# EAGLE design left thumb (EAGLE 9.4.2)
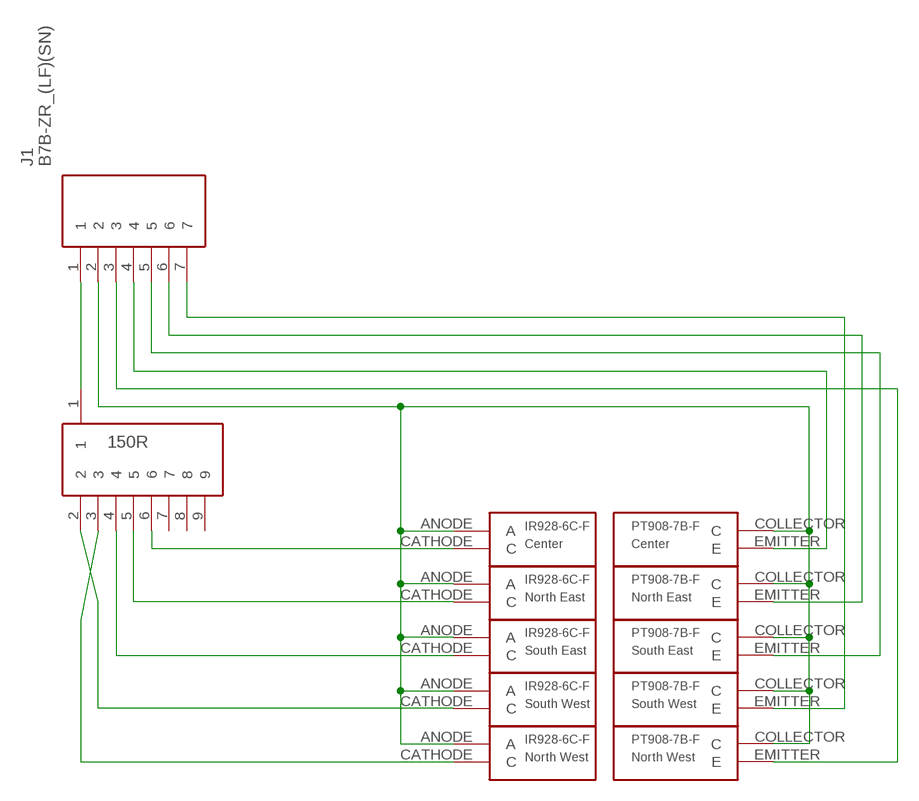
[diagram p0: schematic, sheet 1]

## Parts
J1  B7B-ZR_(LF)(SN)  [SHDR7W50P0X150_1X7_1200X350X45]
LED1  Center  IR928-6C-F  [IR928-6C-F]
LED2  North East  IR928-6C-F  [IR928-6C-F]
LED3  South East  IR928-6C-F  [IR928-6C-F]
LED4  South West  IR928-6C-F  [IR928-6C-F]
LED5  North West  IR928-6C-F  [IR928-6C-F]
PT1  Center  PT908-7B-F  [PT908-7B-F]
PT2  North East  PT908-7B-F  [PT908-7B-F]
PT3  South East  PT908-7B-F  [PT908-7B-F]
PT4  South West  PT908-7B-F  [PT908-7B-F]
PT5  North West  PT908-7B-F  [PT908-7B-F]
RN1  150R  9PIN-RESISTOR-NETWORK9PIN-RESISTOR-NETWORK  [9PIN-RESISTOR-NETWORK]

## Nets
N$1: J1.1 RN1.1
N$2: LED5.CATHODE(C) RN1.3
N$3: LED4.CATHODE(C) RN1.2
N$4: LED3.CATHODE(C) RN1.4
N$5: LED2.CATHODE(C) RN1.5
N$6: LED1.CATHODE(C) RN1.6
N$7: J1.2 LED1.ANODE(A) LED2.ANODE(A) LED3.ANODE(A) LED4.ANODE(A) LED5.ANODE(A) PT1.COLLECTOR(C) PT2.COLLECTOR(C) PT3.COLLECTOR(C) PT4.COLLECTOR(C) PT5.COLLECTOR(C)
N$8: J1.4 PT1.EMITTER(E)
N$9: J1.6 PT2.EMITTER(E)
N$10: J1.5 PT3.EMITTER(E)
N$11: J1.7 PT4.EMITTER(E)
N$12: J1.3 PT5.EMITTER(E)
Unconnected: RN1.7 RN1.8 RN1.9

## Library data of the parts
J1 = SamacSys_Parts:B7B-ZR_(LF)(SN): Connector,Multipole,PCB use,B7B-ZR (LF)( JST ZH Series, 1.5mm Pitch 7 Way 1 Row Straight PCB Header, Solder Termination, 1A Source: Datasheet <http://docs-emea.rs-online.com/webdocs/1147/0900766b81147f94.pdf>; DESCRIPTION: Connector,Multipole,PCB use,B7B-ZR (LF)( JST ZH Series, 1.5mm Pitch 7 Way 1 Row Straight PCB Header, Solder Termination, 1A; HEIGHT: 4.5mm; MANUFACTURER_NAME: JST (JAPAN SOLDERLESS TERMINALS); MANUFACTURER_PART_NUMBER: B7B-ZR (LF)(SN); RS_PART_NUMBER: 7620828; RS_PRICE-STOCK: https://uk.rs-online.com/web/p/products/7620828
LED1-LED5 = IR928-6C-F:IR928-6C-F
PT1-PT5 = PT908-7B-F:PT908-7B-F
RN1 = 9 pin resistor network:9PIN-RESISTOR-NETWORK: 9 pin, standard resistor network; HEIGHT: mm

## Board
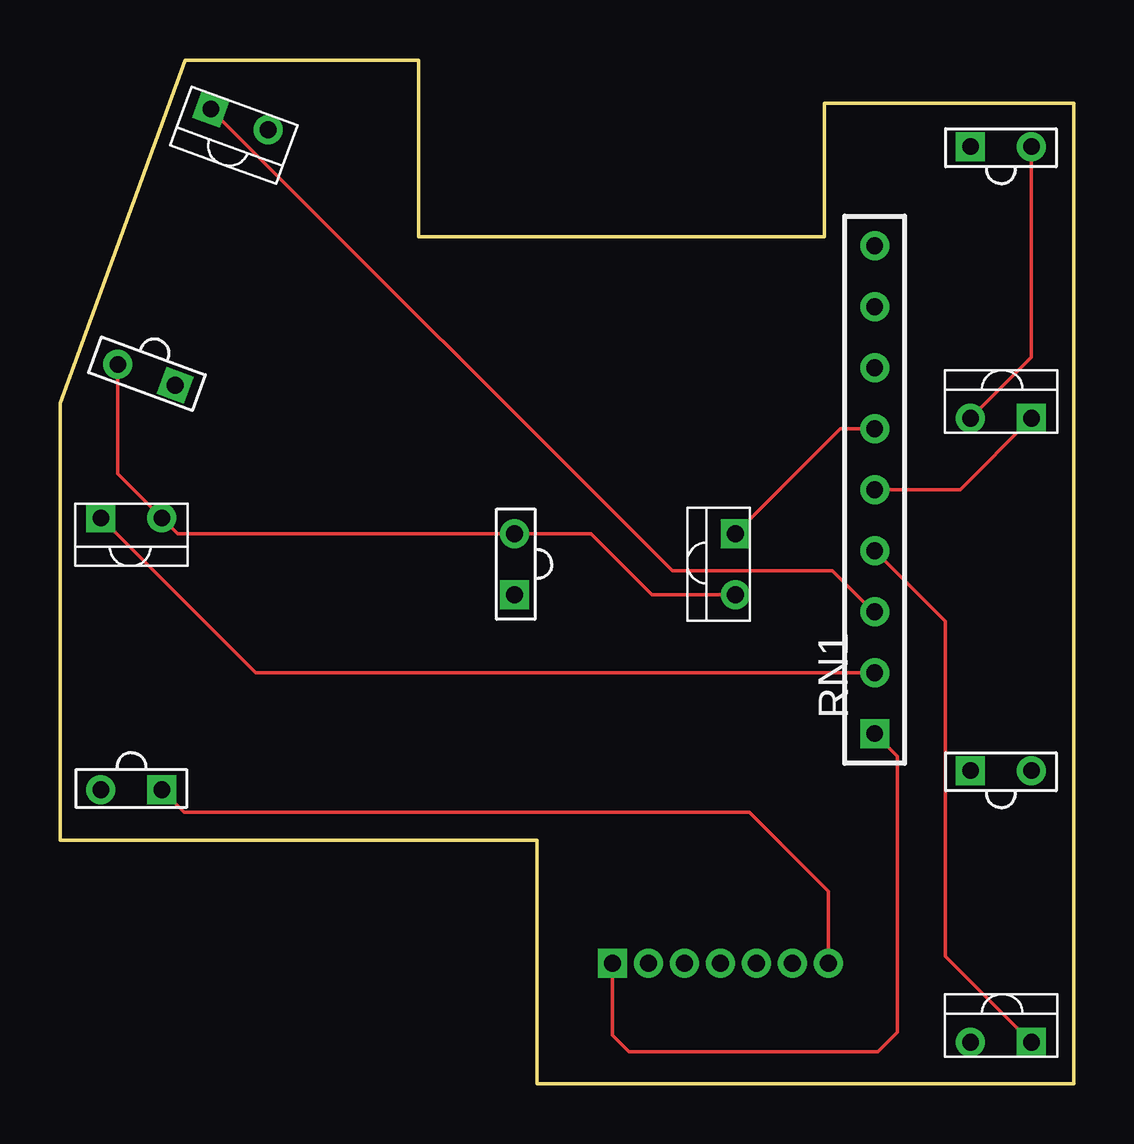
[diagram p1: board, top side]
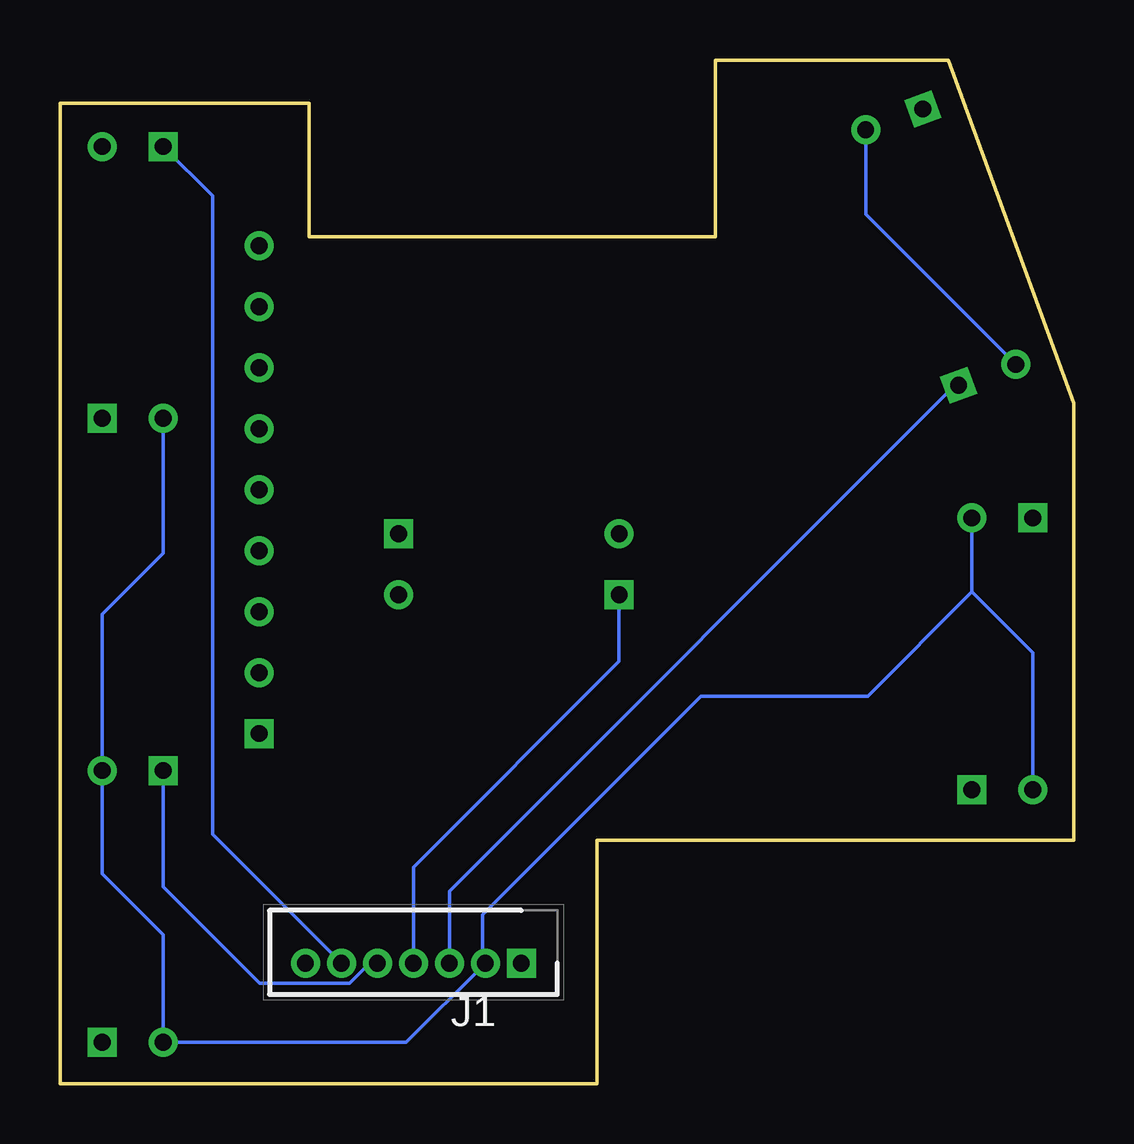
[diagram p2: board, bottom side, seen from below]

Size 42.26 x 42.66 mm. Coordinates in mm from the lower left corner, seen from the top.
Outline: 0,28.34 0,10.15 19.89,10.15 19.89,0 42.26,0 42.26,40.85 31.87,40.85 31.87,35.28 14.94,35.28 14.94,42.66 5.22,42.66 0,28.34
Copper layers (1*16): Top 0.035mm / dielectric 1.5mm / Bottom 0.035mm
Design rules "default": minimum track width 6mil, minimum drill 0.35mm, track to track 6mil, track to pad 6mil, pad to pad 6mil, via to via 6mil, smd to smd 6mil, copper to edge 40mil, drill to drill 6mil, minimum pad ring 10mil, minimum via ring 8mil, stop-mask expansion 4mil, vias tented up to drill 0mil, thermal gap 10mil

### Footprints (pad centres in the part's own frame; a part is rotated, then mirrored left to right if it is on the bottom)
SHDR7W50P0X150_1X7_1200X350X45 = drill 0.7 pad 1.1 square: 1 0,0 | drill 0.7 pad 1.1: 2 1.5,0; 3 3,0; 4 4.5,0; 5 6,0; 6 7.5,0; 7 9,0
IR928-6C-F = drill 0.7: ANODE 1.27,0 | drill 0.7 square: CATHODE -1.27,0
PT908-7B-F = drill 0.7: COLLECTOR 1.27,0 | drill 0.7 square: EMITTER -1.27,0
9PIN-RESISTOR-NETWORK = drill 0.7 square: 1 0,0 | drill 0.7: 2 2.54,0; 3 5.08,0; 4 7.62,0; 5 10.16,0; 6 12.7,0; 7 15.24,0; 8 17.78,0; 9 20.32,0

### Placement (x,y rotation side)
J1  23.03,5.02 180 bottom
LED1  28.15,21.65 270 top
LED2  39.23,27.73 180 top
LED3  39.23,1.73 180 top
LED4  2.98,23.57 0 top
LED5  7.48,40.18 340 top
PT1  18.95,21.65 90 top
PT2  39.23,39.05 0 top
PT3  39.23,13.05 0 top
PT4  2.98,12.25 180 top
PT5  3.61,29.54 160 top
RN1  33.96,14.59 90 top

### Tracks (layer width: path | path; a pad name or v marks a point on that pad's centre or on a via)
N$1
  Top 0.152: J1.1 23.03,2.02 23.71,1.34 34.09,1.34 34.9,2.15 34.9,13.65 RN1.1
N$2
  Top 0.152: RN1.3 33.9,19.67 32.2,21.37 25.53,21.37 LED5.CATHODE
N$3
  Top 0.152: LED4.CATHODE 8.15,17.13 RN1.2
N$4
  Top 0.152: RN1.4 36.9,19.27 36.9,5.32 LED3.CATHODE
N$5
  Top 0.152: LED2.CATHODE 37.52,24.75 RN1.5
N$6
  Top 0.152: LED1.CATHODE 32.52,27.29 RN1.6
N$7
  Top 0.152: PT2.COLLECTOR 40.5,30.26 LED2.ANODE | LED1.ANODE 24.67,20.38 22.13,22.92 PT1.COLLECTOR 4.9,22.92 LED4.ANODE 2.42,25.41 PT5.COLLECTOR
  Bottom 0.152: LED2.ANODE 37.96,22.09 40.5,19.55 PT3.COLLECTOR 40.5,8.75 37.96,6.21 LED3.ANODE 27.83,1.73 24.65,4.9 | PT5.COLLECTOR 8.68,36.23 LED5.ANODE | LED4.ANODE 4.25,20.49 | PT4.COLLECTOR 1.71,17.95 4.25,20.49 | J1.2 24.65,4.9 | 4.25,20.49 8.59,16.15 15.54,16.15 24.65,7.04 24.65,4.9
N$8
  Bottom 0.152: PT1.EMITTER 18.95,17.6 27.53,9.02 J1.4
N$9
  Bottom 0.152: PT2.EMITTER 35.9,36.99 35.9,10.39 J1.6
N$10
  Bottom 0.152: PT3.EMITTER 37.96,8.21 33.94,4.19 30.19,4.19 29.35,5.02 J1.5
N$11
  Top 0.152: PT4.EMITTER 5.18,11.32 19.9,11.32 20.37,11.32 28.73,11.32 32.03,8.02 J1.7
N$12
  Bottom 0.152: PT5.EMITTER 4.95,29.1 26.03,8.02 J1.3